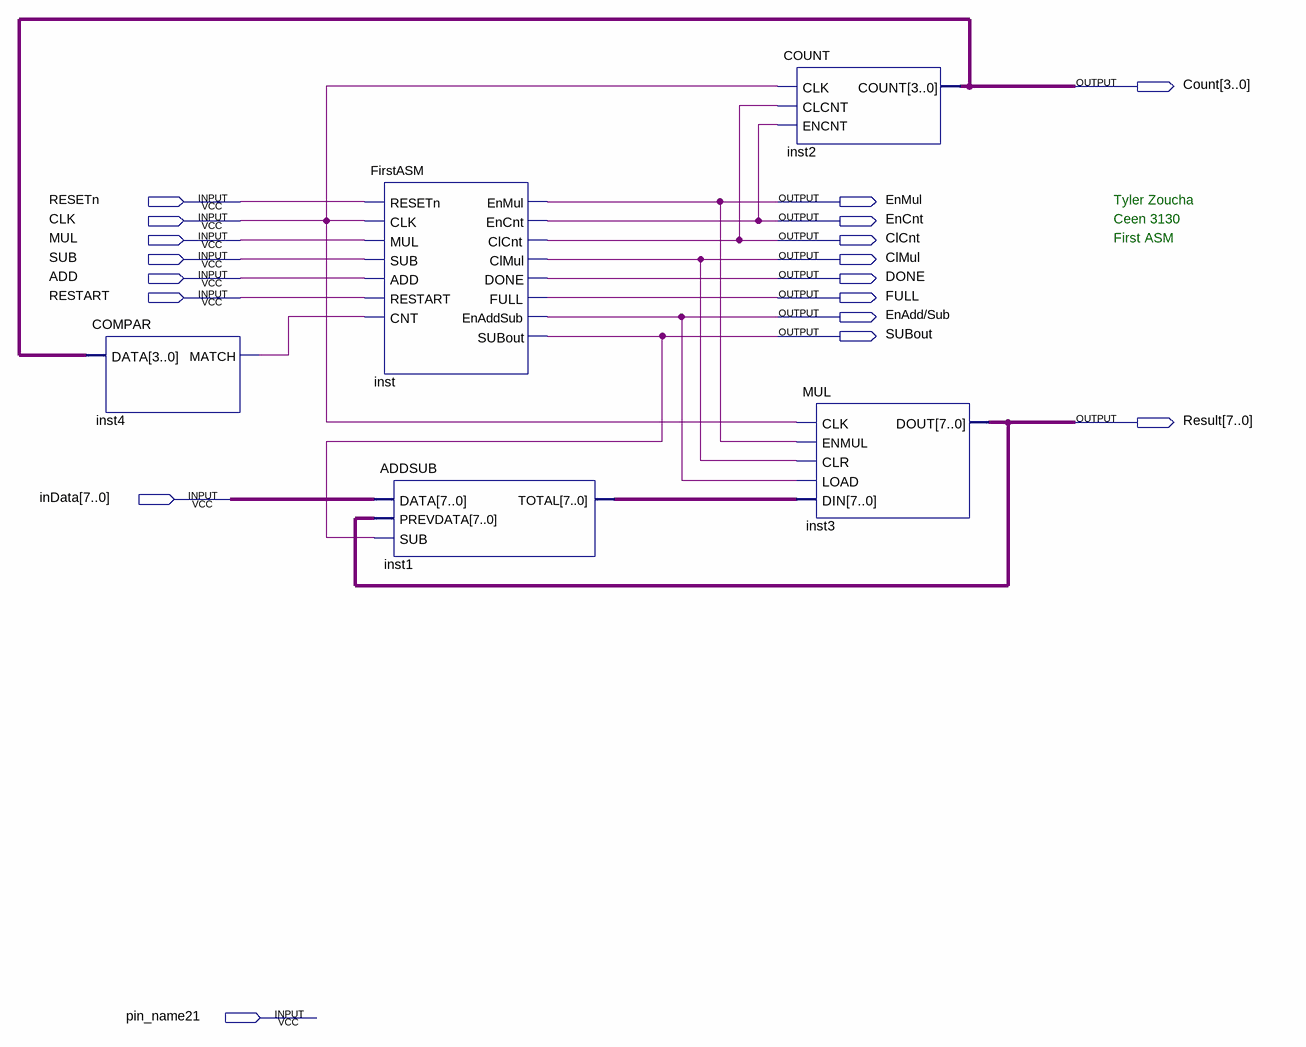
[diagram p0: schematic sheet]
// Quartus schematic Block1.bdf as structural Verilog: 5 symbols, 18 pins
module Block1 (
  input  RESETn,
  input  CLK,
  input  MUL,
  input  SUB,
  input  ADD,
  input  RESTART,
  input  [7:0] inData,
  input  pin_name21,
  output [3:0] Count,
  output EnMul,
  output EnCnt,
  output ClCnt,
  output ClMul,
  output DONE,
  output FULL,
  output \EnAdd/Sub ,
  output SUBout,
  output [7:0] Result
);

  wire inst4_match;
  wire [7:0] inst1_total;

  COMPAR inst4 (.DATA(Count), .MATCH(inst4_match));
  FirstASM inst (
    .RESETn(RESETn), .CLK(CLK), .MUL(MUL), .SUB(SUB), .ADD(ADD), .RESTART(RESTART), .CNT(inst4_match),
    .EnMul(EnMul), .EnCnt(EnCnt), .ClCnt(ClCnt), .ClMul(ClMul), .DONE(DONE), .FULL(FULL),
    .EnAddSub(\EnAdd/Sub ), .SUBout(SUBout));
  ADDSUB inst1 (.DATA(inData), .PREVDATA(Result), .SUB(SUBout), .TOTAL(inst1_total));
  COUNT inst2 (.CLK(CLK), .CLCNT(ClCnt), .ENCNT(EnCnt), .COUNT(Count));
  MUL inst3 (.CLK(CLK), .ENMUL(EnMul), .CLR(ClMul), .LOAD(\EnAdd/Sub ), .DIN(inst1_total), .DOUT(Result));

  // Notes on the sheet:
  //   Tyler Zoucha
  //   Ceen 3130
  //   First ASM
endmodule
